# EAGLE schematic jupace19 (EAGLE 6.5.0)
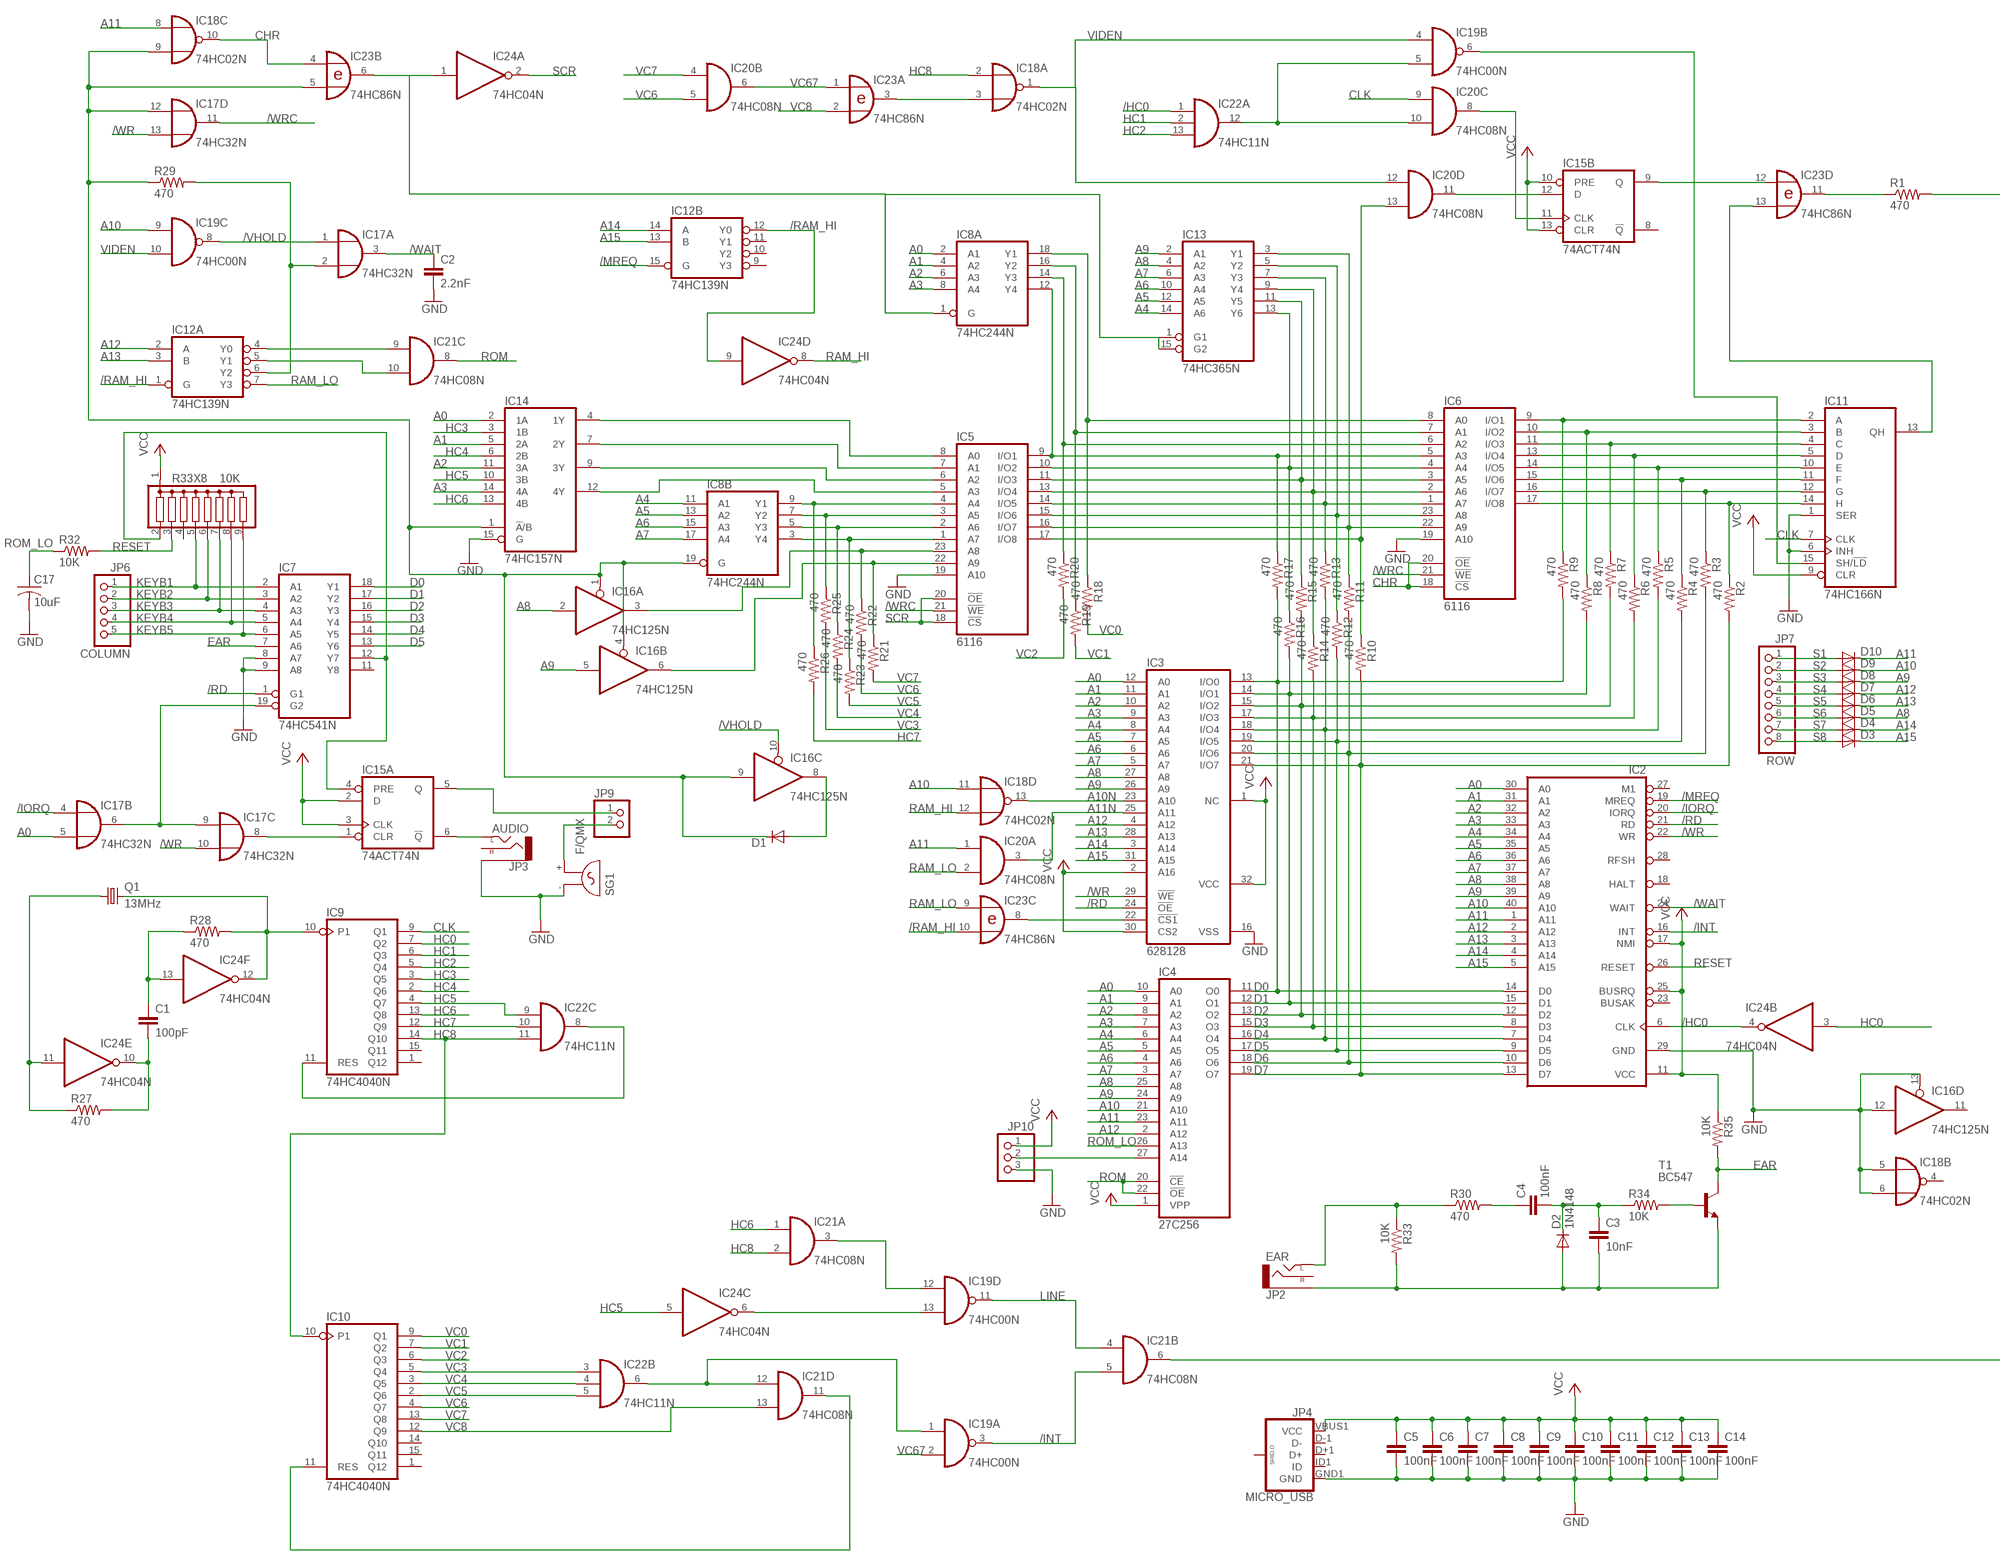
[diagram p0: schematic, sheet 1, part 1 of 2]
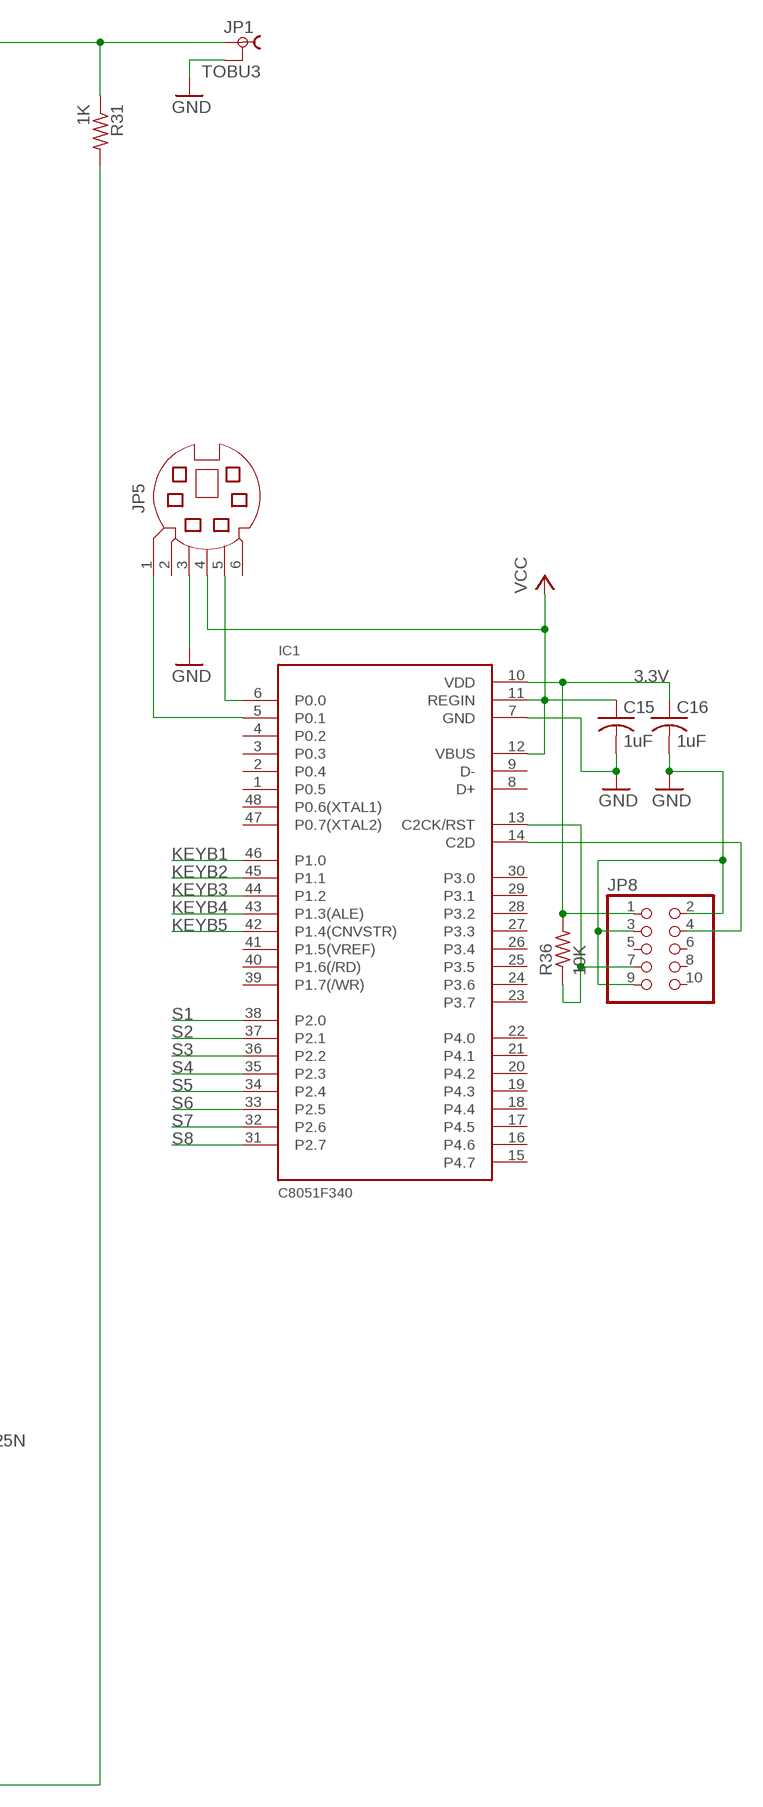
[diagram p1: schematic, sheet 1, part 2 of 2]

## Parts
C1  100pF  C2,5-3  [C2.5-3]
C2  2.2nF  C2,5-3  [C2.5-3]
C3  10nF  C2,5-3  [C2.5-3]
C4  100nF  C2,5-3  [C2.5-3]
C5  100nF  C2,5-3  [C2.5-3]
C6  100nF  C2,5-3  [C2.5-3]
C7  100nF  C2,5-3  [C2.5-3]
C8  100nF  C2,5-3  [C2.5-3]
C9  100nF  C2,5-3  [C2.5-3]
C10  100nF  C2,5-3  [C2.5-3]
C11  100nF  C2,5-3  [C2.5-3]
C12  100nF  C2,5-3  [C2.5-3]
C13  100nF  C2,5-3  [C2.5-3]
C14  100nF  C2,5-3  [C2.5-3]
C15  1uF  C-US025-024X044  [C025-024X044]
C16  1uF  C-US025-024X044  [C025-024X044]
C17  10uF  C-US025-024X044  [C025-024X044]
D1  1N4148DO35-7  [DO35-7]
D2  1N4148  1N4148DO35-7  [DO35-7]
D3  1N4148DO35-7  [DO35-7]
D4  1N4148DO35-7  [DO35-7]
D5  1N4148DO35-7  [DO35-7]
D6  1N4148DO35-7  [DO35-7]
D7  1N4148DO35-7  [DO35-7]
D8  1N4148DO35-7  [DO35-7]
D9  1N4148DO35-7  [DO35-7]
D10  1N4148DO35-7  [DO35-7]
IC1  C8051F340  [TQFP48]
IC2  Z80CPU  [DIL40]
IC3  628128  628128P  [DIL32]
IC4  27C256  27256  [DIL28]
IC5  6116  6116P  [DIL24-6]
IC6  6116  6116P  [DIL24-6]
IC7  74HC541N  [DIL20]
IC8  74HC244N  [DIL20]
IC9  74HC4040N  4040N  [DIL16]
IC10  74HC4040N  4040N  [DIL16]
IC11  74HC166N  [DIL16]
IC12  74HC139N  [DIL16]
IC13  74HC365N  [DIL16]
IC14  74HC157N  [DIL16]
IC15  74ACT74N  [DIL14]
IC16  74HC125N  [DIL14]
IC17  74HC32N  [DIL14]
IC18  74HC02N  [DIL14]
IC19  74HC00N  [DIL14]
IC20  74HC08N  [DIL14]
IC21  74HC08N  [DIL14]
IC22  74HC11N  [DIL14]
IC23  74HC86N  [DIL14]
IC24  74HC04N  [DIL14]
JP1  TOBU3  [TOBU3]
JP2  EAR  AUDIO-JACKPTH  [AUDIO-JACK]
JP3  AUDIO  AUDIO-JACKPTH  [AUDIO-JACK]
JP4  MICRO_USB  USB_MICROB_PLUGCONN-11752  [USB-B-MICRO-SMD_V03]
JP5  MD06SS  [MDIN06SS]
JP6  COLUMN  PINHD-1X5  [1X05]
JP7  ROW  PINHD-1X8  [1X08]
JP8  PINHD-2X5  [2X05]
JP9  PINHD-1X2/90  [1X02/90]
JP10  PINHD-1X3  [1X03]
Q1  13MHz  CRYSTALHC49S  [HC49/S]
R1  470  R-US_0204/7  [0204/7]
R2  470  R-US_0204/7  [0204/7]
R3  470  R-US_0204/7  [0204/7]
R4  470  R-US_0204/7  [0204/7]
R5  470  R-US_0204/7  [0204/7]
R6  470  R-US_0204/7  [0204/7]
R7  470  R-US_0204/7  [0204/7]
R8  470  R-US_0204/7  [0204/7]
R9  470  R-US_0204/7  [0204/7]
R10  470  R-US_0204/7  [0204/7]
R11  470  R-US_0204/7  [0204/7]
R12  470  R-US_0204/7  [0204/7]
R13  470  R-US_0204/7  [0204/7]
R14  470  R-US_0204/7  [0204/7]
R15  470  R-US_0204/7  [0204/7]
R16  470  R-US_0204/7  [0204/7]
R17  470  R-US_0204/7  [0204/7]
R18  470  R-US_0204/7  [0204/7]
R19  470  R-US_0204/7  [0204/7]
R20  470  R-US_0204/7  [0204/7]
R21  470  R-US_0204/7  [0204/7]
R22  470  R-US_0204/7  [0204/7]
R23  470  R-US_0204/7  [0204/7]
R24  470  R-US_0204/7  [0204/7]
R25  470  R-US_0204/7  [0204/7]
R26  470  R-US_0204/7  [0204/7]
R27  470  R-US_0204/7  [0204/7]
R28  470  R-US_0204/7  [0204/7]
R29  470  R-US_0204/7  [0204/7]
R30  470  R-US_0204/7  [0204/7]
R31  1K  R-US_0204/7  [0204/7]
R32  10K  R-US_0204/7  [0204/7]
R33  10K  R-US_0204/7  [0204/7]
R33X8  10K  G08R  [SIL9]
R34  10K  R-US_0204/7  [0204/7]
R35  10K  R-US_0204/7  [0204/7]
R36  10K  R-US_0204/7  [0204/7]
SG1  F/QMX  [F/QMX]
T1  BC547  [TO92]

## Nets
3.3V: C16.1 IC1.10(VDD) JP8.1 R36.2
/HC0: IC2.6(CLK) IC22.1(A:I0) IC24.4(B:O)
/INT: IC2.16(INT) IC19.3(A:O) IC21.5(B:I1)
/IORQ: IC2.20(IORQ) IC17.4(B:I0)
/MREQ: IC2.19(MREQ) IC12.15(B:G)
/RAM_HI: IC12.1(A:G) IC12.12(B:Y0) IC23.10(C:I1) IC24.9(D:I)
/RD: IC2.21(RD) IC3.24(!OE) IC7.1(G1)
/VHOLD: IC16.10(C:OE) IC17.1(A:I0) IC19.8(C:O)
/WAIT: C2.1 IC2.24(WAIT) IC17.3(A:O)
/WR: IC2.22(WR) IC3.29(!WE) IC17.10(C:I1) IC17.13(D:I1)
/WRC: IC5.21(!WE) IC6.21(!WE) IC17.11(D:O)
A0: IC2.30(A0) IC8.2(A:A1) IC14.2(1A) IC17.5(B:I1)
A1: IC2.31(A1) IC8.4(A:A2) IC14.5(2A)
A2: IC2.32(A2) IC8.6(A:A3) IC14.11(3A)
A3: IC2.33(A3) IC8.8(A:A4) IC14.14(4A)
A4: IC2.34(A4) IC8.11(B:A1) IC13.14(A6)
A5: IC2.35(A5) IC8.13(B:A2) IC13.12(A5)
A6: IC2.36(A6) IC8.15(B:A3) IC13.10(A4)
A7: IC2.37(A7) IC8.17(B:A4) IC13.6(A3)
A8: D5.C IC2.38(A8) IC13.4(A2) IC16.2(A:I)
A9: D8.C IC2.39(A9) IC13.2(A1) IC16.5(B:I)
A10: D9.C IC2.40(A10) IC18.11(D:I0) IC19.9(C:I0)
A10N: IC3.23(A10) IC18.13(D:O)
A11: D10.C IC2.1(A11) IC20.1(A:I0)
A11N: IC3.25(A11) IC20.3(A:O)
A12: D7.C IC2.2(A12) IC3.4(A12) IC12.2(A:A)
A13: D6.C IC2.3(A13) IC3.28(A13) IC12.3(A:B)
A14: D4.C IC2.4(A14) IC3.3(A14) IC12.14(B:A)
A15: D3.C IC2.5(A15) IC3.31(A15) IC12.13(B:B)
CHR: IC6.18(!CS) IC6.20(!OE) IC18.10(C:O) IC23.4(B:I0)
CLK: IC9.9(Q1) IC11.7(CLK) IC20.9(C:I0)
D0: IC2.14(D0) IC3.13(I/O0) IC4.11(O0) IC7.18(Y1) R9.2 R17.2
D1: IC2.15(D1) IC3.14(I/O1) IC4.12(O1) IC7.17(Y2) R8.2 R16.2
D2: IC2.12(D2) IC3.15(I/O2) IC4.13(O2) IC7.16(Y3) R7.2 R15.2
D3: IC2.8(D3) IC3.17(I/O3) IC4.15(O3) IC7.15(Y4) R6.2 R14.2
D4: IC2.7(D4) IC3.18(I/O4) IC4.16(O4) IC7.14(Y5) R5.2 R13.2
D5: IC2.9(D5) IC3.19(I/O5) IC4.17(O5) IC7.13(Y6) R4.2 R12.2
D6: IC2.10(D6) IC3.20(I/O6) IC4.18(O6) R3.2 R11.2
D7: IC2.13(D7) IC3.21(I/O7) IC4.19(O7) R2.2 R10.2
EAR: IC7.7(A6) R35.2 T1.3(C)
GND: C2.2 C5.2 C6.2 C7.2 C8.2 C9.2 C10.2 C11.2 C12.2 C13.2 C14.2 C15.2 C16.2 C17.2 IC1.7(GND) IC2.29(GND) IC3.16(VSS) IC5.19(A10) IC6.19(A10) IC7.8(A7) IC7.9(A8) IC11.1(SER) IC11.6(INH) IC14.15(G) IC16.12(D:I) IC16.13(D:OE) IC18.5(B:I0) IC18.6(B:I1) JP1.2 JP1.2@1 JP1.2@2 JP3.SLEEVE JP4.GND1(GND) JP5.3 JP8.2 JP8.3 JP8.9 JP10.3 SG1.-
HC0: IC24.3(B:I)
HC1: IC22.2(A:I1)
HC2: IC22.13(A:I2)
HC3: IC14.3(1B)
HC4: IC14.6(2B)
HC5: IC14.10(3B) IC22.9(C:I0) IC24.5(C:I)
HC6: IC14.13(4B) IC21.1(A:I0)
HC7: IC22.10(C:I1) R26.2
HC8: IC10.10(P1) IC18.2(A:I0) IC21.2(A:I1) IC22.11(C:I2)
KEYB1: IC1.46(P1.0) IC7.2(A1) JP6.1 R33X8.5
KEYB2: IC7.3(A2) JP6.2 R33X8.6
KEYB3: IC7.4(A3) JP6.3 R33X8.7
KEYB4: IC7.5(A4) JP6.4 R33X8.8
KEYB5: IC7.6(A5) JP6.5 R33X8.9
LINE: IC19.11(D:O) IC21.4(B:I0)
N$1: IC8.1(A:G) IC23.6(B:O) IC24.1(A:I)
N$2: IC5.9(I/O1) IC6.5(A3) IC8.12(A:Y4) R17.1
N$3: IC13.1(G1) IC13.15(G2)
N$4: IC15.12(B:D) IC20.11(D:O)
N$5: IC15.11(B:CLK) IC20.8(C:O)
N$6: IC18.3(A:I1) IC23.3(A:O)
N$7: IC15.9(B:Q)
N$8: IC12.6(A:Y2) IC17.2(A:I1) R29.2
N$9: IC5.23(A8) IC16.3(A:O) R22.1
N$10: IC11.15(SH/!LD) IC19.6(B:O)
N$11: IC7.12(Y7) IC15.4(A:PRE) R33X8.2
N$12: IC12.4(A:Y0) IC21.9(C:I0)
N$13: IC12.5(A:Y1) IC21.10(C:I1)
N$14: IC6.6(A2) IC8.14(A:Y3) R20.1
N$15: IC6.7(A1) IC8.16(A:Y2) R19.1
N$16: IC6.8(A0) IC8.18(A:Y1) R18.1
N$17: IC5.10(I/O2) IC6.4(A4) IC13.13(Y6) R16.1
N$18: IC5.11(I/O3) IC6.3(A5) IC13.11(Y5) R15.1
N$19: IC5.13(I/O4) IC6.2(A6) IC13.9(Y4) R14.1
N$20: IC5.14(I/O5) IC6.1(A7) IC13.7(Y3) R13.1
N$21: IC5.15(I/O6) IC6.23(A8) IC13.5(Y2) R12.1
N$22: IC5.16(I/O7) IC6.22(A9) IC13.3(Y1) R11.1
N$23: IC5.17(I/O8) IC20.13(D:I1) R10.1
N$24: IC5.1(A7) IC8.3(B:Y4) R23.1
N$25: IC5.2(A6) IC8.5(B:Y3) R24.1
N$26: IC5.3(A5) IC8.7(B:Y2) R25.1
N$27: IC5.4(A4) IC8.9(B:Y1) R26.1
N$28: IC19.5(B:I1) IC20.10(C:I1) IC22.12(A:O)
N$29: C3.2 D2.A JP2.SLEEVE R33.2 T1.1(E)
N$30: IC5.22(A9) IC16.6(B:O) R21.1
N$31: IC5.5(A3) IC14.12(4Y)
N$32: IC5.6(A2) IC14.9(3Y)
N$33: IC5.7(A1) IC14.7(2Y)
N$34: IC5.8(A0) IC14.4(1Y)
N$35: D1.A IC16.8(C:O)
N$36: IC7.19(G2) IC17.6(B:O) IC17.9(C:I0)
N$37: IC15.1(A:CLR) IC17.8(C:O)
N$38: D1.C IC8.19(B:G) IC14.1(!A!/B) IC16.1(A:OE) IC16.4(B:OE) IC16.9(C:I) IC17.12(D:I0) IC18.9(C:I1) IC23.5(B:I1) R29.1
N$39: IC15.5(A:Q) JP9.1
N$41: IC6.9(I/O1) IC11.2(A) R9.1
N$42: IC6.10(I/O2) IC11.3(B) R8.1
N$43: IC6.11(I/O3) IC11.4(C) R7.1
N$44: IC6.13(I/O4) IC11.5(D) R6.1
N$45: IC6.14(I/O5) IC11.10(E) R5.1
N$46: IC6.15(I/O6) IC11.11(F) R4.1
N$47: IC6.16(I/O7) IC11.12(G) R3.1
N$48: IC6.17(I/O8) IC11.14(H) R2.1
N$49: IC11.13(QH) IC23.13(D:I1)
N$58: IC3.22(!CS1) IC23.8(C:O)
N$59: IC4.27(A14) JP10.2
N$60: C1.1 IC24.13(F:I) R28.1
N$61: C1.2 IC24.10(E:O) R27.2
N$63: IC24.11(E:I) Q1.1 R27.1
N$64: IC9.11(RES) IC22.8(C:O)
N$65: IC9.10(P1) IC24.12(F:O) Q1.2 R28.2
N$70: IC19.1(A:I0) IC21.12(D:I0) IC22.6(B:O)
N$72: IC10.11(RES) IC21.11(D:O)
N$73: IC19.13(D:I1) IC24.6(C:O)
N$74: IC19.12(D:I0) IC21.3(A:O)
N$75: IC23.11(D:O) R1.1
N$76: JP1.1 R1.2 R31.1
N$77: IC21.6(B:O) R31.2
N$78: IC15.6(A:!Q) JP3.TIP(LEFT)
N$79: JP2.TIP(LEFT) R30.1 R33.1
N$80: C4.1 R30.2
N$81: C3.1 C4.2 D2.C R34.1
N$83: R34.2 T1.2(B)
N$86: JP9.2 SG1.+
N$87: IC1.14(C2D) JP8.4
N$88: IC1.13(C2CK/RST) JP8.7 R36.1
N$89: IC1.6(P0.0) JP5.5
N$90: IC1.5(P0.1) JP5.1
RAM_HI: IC18.12(D:I1) IC24.8(D:O)
RAM_LO: IC12.7(A:Y3) IC20.2(A:I1) IC23.9(C:I0)
RESET: IC2.26(RESET) R32.2 R33X8.3
ROM: IC4.20(!CE) IC4.22(!OE) IC21.8(C:O)
ROM_LO: C17.1 IC4.26(A13) R32.1
S1: D10.A JP7.1
S2: D9.A JP7.2
S3: D8.A JP7.3
S4: D7.A JP7.4
S5: D6.A JP7.5
S6: D5.A JP7.6
S7: D4.A JP7.7
S8: D3.A JP7.8
SCR: IC5.18(!CS) IC5.20(!OE) IC24.2(A:O)
VC0: IC10.9(Q1) R18.2
VC1: R19.2
VC2: R20.2
VC3: IC22.3(B:I0) R25.2
VC4: IC22.4(B:I1) R24.2
VC5: IC22.5(B:I2) R23.2
VC6: IC20.5(B:I1) R22.2
VC7: IC20.4(B:I0) R21.2
VC8: IC21.13(D:I1) IC23.2(A:I1)
VC67: IC19.2(A:I1) IC20.6(B:O) IC23.1(A:I0)
VCC: C5.1 C6.1 C7.1 C8.1 C9.1 C10.1 C11.1 C12.1 C13.1 C14.1 C15.1 IC1.11(REGIN) IC1.12(VBUS) IC2.11(VCC) IC2.17(NMI) IC2.25(BUSRQ) IC3.1(NC) IC3.2(A16) IC3.30(CS2) IC3.32(VCC) IC4.1(VPP) IC11.9(CLR) IC15.2(A:D) IC15.3(A:CLK) IC15.10(B:PRE) IC15.13(B:CLR) JP4.VBUS1(VCC) JP5.4 JP10.1 R33X8.1 R35.1
VIDEN: IC18.1(A:O) IC19.4(B:I0) IC19.10(C:I1) IC20.12(D:I0)
Unconnected: IC1.1(P0.5) IC1.2(P0.4) IC1.3(P0.3) IC1.4(P0.2) IC1.8(D+) IC1.9(D-) IC1.15(P4.7) IC1.16(P4.6) IC1.17(P4.5) IC1.18(P4.4) IC1.19(P4.3) IC1.20(P4.2) IC1.21(P4.1) IC1.22(P4.0) IC1.23(P3.7) IC1.24(P3.6) IC1.25(P3.5) IC1.26(P3.4) IC1.27(P3.3) IC1.28(P3.2) IC1.29(P3.1) IC1.30(P3.0) IC1.31(P2.7) IC1.32(P2.6) IC1.33(P2.5) IC1.34(P2.4) IC1.35(P2.3) IC1.36(P2.2) IC1.37(P2.1) IC1.38(P2.0) IC1.39(P1.7(/WR)) IC1.40(P1.6(/RD)) IC1.41(P1.5(VREF)) IC1.42(P1.4(CNVSTR)) IC1.43(P1.3(ALE)) IC1.44(P1.2) IC1.45(P1.1) IC1.47(P0.7(XTAL2)) IC1.48(P0.6(XTAL1)) IC2.18(HALT) IC2.23(BUSAK) IC2.27(M1) IC2.28(RFSH) IC3.5(A7) IC3.6(A6) IC3.7(A5) IC3.8(A4) IC3.9(A3) IC3.10(A2) IC3.11(A1) IC3.12(A0) IC3.26(A9) IC3.27(A8) IC4.2(A12) IC4.3(A7) IC4.4(A6) IC4.5(A5) IC4.6(A4) IC4.7(A3) IC4.8(A2) IC4.9(A1) IC4.10(A0) IC4.21(A10) IC4.23(A11) IC4.24(A9) IC4.25(A8) IC7.11(Y8) IC9.1(Q12) IC9.2(Q6) IC9.3(Q5) IC9.4(Q7) IC9.5(Q4) IC9.6(Q3) IC9.7(Q2) IC9.12(Q9) IC9.13(Q8) IC9.14(Q10) IC9.15(Q11) IC10.1(Q12) IC10.2(Q6) IC10.3(Q5) IC10.4(Q7) IC10.5(Q4) IC10.6(Q3) IC10.7(Q2) IC10.12(Q9) IC10.13(Q8) IC10.14(Q10) IC10.15(Q11) IC12.9(B:Y3) IC12.10(B:Y2) IC12.11(B:Y1) IC15.8(B:!Q) IC16.11(D:O) IC18.4(B:O) IC18.8(C:I0) IC23.12(D:I0) JP2.RING(RIGHT) JP3.RING(RIGHT) JP4.D+1(D+) JP4.D-1(D-) JP4.ID1(ID) JP4.SHIELD1(SHIELD) JP4.SHIELD2(SHIELD) JP4.SHIELD3(SHIELD) JP5.2 JP5.6 JP8.5 JP8.6 JP8.8 JP8.10 R33X8.4

## Power pins joined to a net without a drawn wire
GND: IC4.14(GND) IC5.12(GND) IC6.12(GND) IC7.10(GND) IC8.10(P:GND) IC11.8(GND) IC12.8(P:GND) IC13.8(GND) IC14.8(GND) IC15.7(P:GND) IC16.7(P:GND) IC17.7(P:GND) IC18.7(P:GND) IC19.7(P:GND) IC20.7(P:GND) IC21.7(P:GND) IC22.7(P:GND) IC23.7(P:GND) IC24.7(P:GND)
VCC: IC4.28(VCC) IC5.24(VCC) IC6.24(VCC) IC7.20(VCC) IC8.20(P:VCC) IC11.16(VCC) IC12.16(P:VCC) IC13.16(VCC) IC14.16(VCC) IC15.14(P:VCC) IC16.14(P:VCC) IC17.14(P:VCC) IC18.14(P:VCC) IC19.14(P:VCC) IC20.14(P:VCC) IC21.14(P:VCC) IC22.14(P:VCC) IC23.14(P:VCC) IC24.14(P:VCC)
VDD: IC9.16(VDD) IC10.16(VDD)
VSS: IC9.8(VSS) IC10.8(VSS)

## Library data of the parts
C1-C14 = capacitor-wima:C: CAPACITOR naming: grid - package width
C15-C17 = resistor:C-US: CAPACITOR, American symbol
D1-D10 = diode:1N4148: DIODE high speed (Philips)
IC1 = silabs-2:C8051F340: Full Speed USB Flash MCU
IC2 = zilog:Z80CPU: Z80 FAMILY DEVICE
IC3 = memory-hitachi:628128P: MEMORY; OC_FARNELL: unknown; OC_NEWARK: unknown
IC4 = memory:27256: MEMORY
IC5 IC6 = memory-idt:6116P: MEMORY; OC_FARNELL: unknown; OC_NEWARK: unknown
IC7 = 74xx-eu:74*541: Octal BUFFER and LINE DRIVER, 3-state
IC8 = 74xx-eu:74*244: Octal BUFFER and LINE DRIVER, 3-state
IC9 IC10 = 40xx:4040: 12-stage binary/ripple COUNTER
IC11 = 74xx-eu:74*166: 8-bit parallel load SHIFT REGISTER
IC12 = 74xx-eu:74*139: Dual 2-line to 4-line DECODER/DEMULTIPLEXER
IC13 = 74xx-eu:74*365: Hex BUS DRIVER, 3-state
IC14 = 74xx-eu:74*157: Quadruple 2-line to 1-line data SELECTOR/MULTIPLEXER
IC15 = 74xx-eu:74*74: Dual D type positive edge triggered FLIP FLOP, preset and clear
IC16 = 74xx-eu:74*125: Quad bus BUFFER, 3-state
IC17 = 74xx-eu:74*32: Quad 2-input OR gate
IC18 = 74xx-eu:74*02: Quad 2-input NOR gate
IC19 = 74xx-eu:74*00: Quad 2-input NAND gate
IC20 IC21 = 74xx-eu:74*08: Quad 2-input AND gate
IC22 = 74xx-eu:74*11: Triple 3-input AND gate
IC23 = 74xx-eu:74*86: Quad 2-input EXCLUSIVE-OR (XOR) gate
IC24 = 74xx-eu:74*04: Hex INVERTER
JP1 = con-hirschmann:TOBU3: Female Cinch CONNECTOR ( RCA Jack ); MF: FARNELL; MPN: TOBU 3; OC_FARNELL: 592791; OC_NEWARK: 06WX5914
JP2 JP3 = SparkFun-Connectors:AUDIO-JACK: 3.5mm Audio Jack Simple 3.5mm common PCB mount audio jack. SKU: PRT-08032
JP4 = SparkFun-Connectors:USB_MICROB_PLUG: USB Micro-B connectors Some male, some female. Watch your step!; PROD_ID: CONN-11752
JP5 = con-yamaichi:MD06SS: YAMAICHI CONNECTOR; OC_FARNELL: unknown; OC_NEWARK: unknown
JP6 = pinhead:PINHD-1X5: PIN HEADER
JP7 = pinhead:PINHD-1X8: PIN HEADER
JP8 = pinhead:PINHD-2X5: PIN HEADER
JP9 = pinhead:PINHD-1X2: PIN HEADER
JP10 = pinhead:PINHD-1X3: PIN HEADER
Q1 = crystal:CRYSTAL: CRYSTAL; OC_FARNELL: 1667008; OC_NEWARK: unknown
R1-R36 = resistor:R-US_: RESISTOR, American symbol
R33X8 = resistor-sil:G08R: SIL RESISTOR; OC_FARNELL: unknown; OC_NEWARK: unknown
SG1 = buzzer:F/QMX: BUZZER Source: Buerklin; OC_FARNELL: unknown; OC_NEWARK: unknown
T1 = transistor:BC547: NPN TRANSISTOR